# EAGLE design VFDControl (EAGLE 6.6.0)
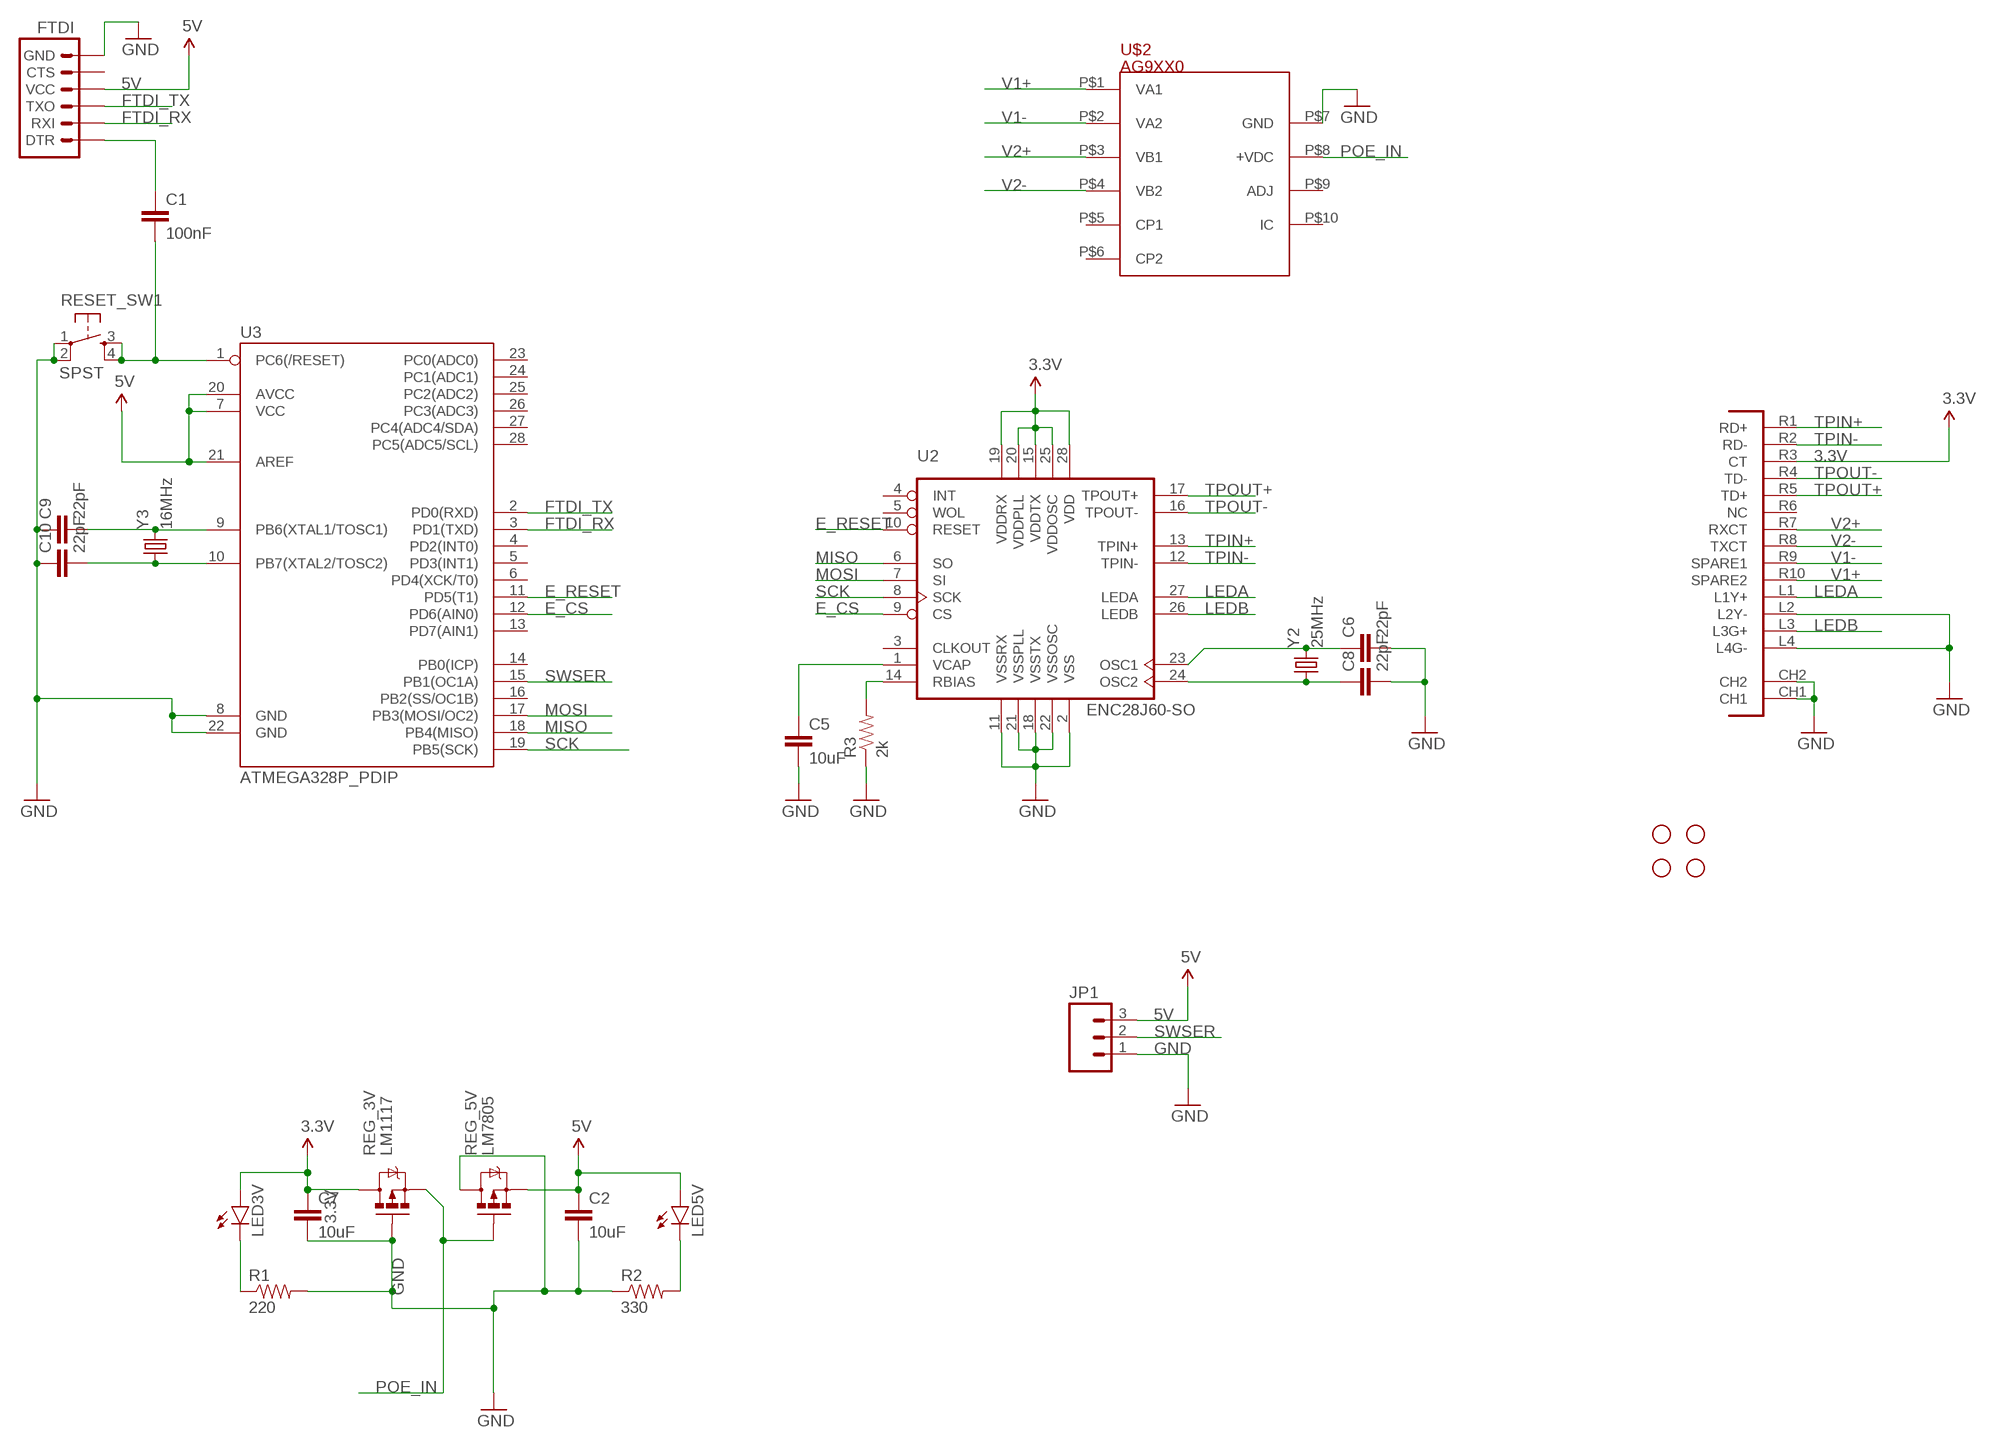
[diagram p0: schematic, sheet 1]

## Parts
C1  100nF  CAPPTH  [CAP-PTH-SMALL]
C2  10uF  CAPPTH  [CAP-PTH-SMALL]
C5  10uF  CAPPTH  [CAP-PTH-SMALL]
C6  22pF  CAPPTH  [CAP-PTH-SMALL]
C7  10uF  CAPPTH  [CAP-PTH-SMALL]
C8  22pF  CAPPTH  [CAP-PTH-SMALL]
C9  22pF  CAPPTH  [CAP-PTH-SMALL]
C10  22pF  CAPPTH  [CAP-PTH-SMALL]
FTDI  ARDUINO_SERIAL_PROGRAMPTH  [1X06]
JP1  M03PTH  [1X03]
LED3V  LED3MM  [LED3MM]
LED5V  LED3MM  [LED3MM]
R1  220  RESISTORPTH-1/4W-VERT  [AXIAL-0.1]
R2  330  RESISTORPTH-1/4W-VERT  [AXIAL-0.1]
R3  2k  RESISTORPTH-1/4W-VERT  [AXIAL-0.1]
REG_3V  LM1117  MOSFET-PCHANNELFQP27P06  [TO220V]
REG_5V  LM7805  MOSFET-PCHANNELFQP27P06  [TO220V]
RESET_SW1  SPST  TACTILE-SWITCH-PTH  [TAC-SWITCH-PTH]
STANDOFF1  STAND-OFF  [STAND-OFF]
STANDOFF2  STAND-OFF  [STAND-OFF]
STANDOFF3  STAND-OFF  [STAND-OFF]
STANDOFF4  STAND-OFF  [STAND-OFF]
U2  ENC28J60-SO  [SO28W]
U3  ATMEGA328P_PDIP  [DIL28-3]
U$2  AG9XX0  [AG9000]
U$3  POE-RJ45  [POE-RJ45]
Y2  25MHz  CRYSTALHC49US  [HC49US]
Y3  16MHz  CRYSTALHC49US  [HC49US]

## Nets
3.3V: C7.1 LED3V.A REG_3V.2(D) U2.15(VDDTX) U2.19(VDDRX) U2.20(VDDPLL) U2.25(VDDOSC) U2.28(VDD) U$3.R3(CT)
5V: C2.1 FTDI.4(VCC) JP1.3 LED5V.A REG_5V.3(S) U3.7(VCC) U3.20(AVCC) U3.21(AREF)
E_CS: U2.9(CS) U3.12(PD6(AIN0))
E_RESET: U2.10(RESET) U3.11(PD5(T1))
FTDI_RX: FTDI.2(RXI) U3.3(PD1(TXD))
FTDI_TX: FTDI.3(TXO) U3.2(PD0(RXD))
GND: C2.2 C5.2 C6.2 C7.2 C8.2 C9.1 C10.1 FTDI.6(GND) JP1.1 R1.P$2 R2.P$1 R3.P$1 REG_3V.1(G) REG_5V.2(D) RESET_SW1.1 RESET_SW1.2 U2.2(VSS) U2.11(VSSRX) U2.18(VSSTX) U2.21(VSSPLL) U2.22(VSSOSC) U3.8(GND) U3.22(GND) U$2.P$7(GND) U$3.CH1 U$3.CH2 U$3.L2(L2Y-) U$3.L4(L4G-)
LEDA: U2.27(LEDA) U$3.L1(L1Y+)
LEDB: U2.26(LEDB) U$3.L3(L3G+)
MISO: U2.6(SO) U3.18(PB4(MISO))
MOSI: U2.7(SI) U3.17(PB3(MOSI/OC2))
N$1: LED3V.K(C) R1.P$1
N$2: LED5V.K(C) R2.P$2
N$3: R3.P$2 U2.14(RBIAS)
N$4: C5.1 U2.1(VCAP)
N$5: C6.1 U2.23(OSC1) Y2.2
N$6: C8.1 U2.24(OSC2) Y2.1
N$20: C9.2 U3.9(PB6(XTAL1/TOSC1)) Y3.2
N$21: C10.2 U3.10(PB7(XTAL2/TOSC2)) Y3.1
N$37: C1.1 FTDI.1(DTR)
POE_IN: REG_3V.3(S) REG_5V.1(G) U$2.P$8(+VDC)
RESET: C1.2 RESET_SW1.3 RESET_SW1.4 U3.1(PC6(/RESET))
SCK: U2.8(SCK) U3.19(PB5(SCK))
SWSER: JP1.2 U3.15(PB1(OC1A))
TPIN+: U2.13(TPIN+) U$3.R1(RD+)
TPIN-: U2.12(TPIN-) U$3.R2(RD-)
TPOUT+: U2.17(TPOUT+) U$3.R5(TD+)
TPOUT-: U2.16(TPOUT-) U$3.R4(TD-)
V1+: U$2.P$1(VA1) U$3.R10(SPARE2)
V1-: U$2.P$2(VA2) U$3.R9(SPARE1)
V2+: U$2.P$3(VB1) U$3.R7(RXCT)
V2-: U$2.P$4(VB2) U$3.R8(TXCT)
Unconnected: FTDI.5(CTS) U2.3(CLKOUT) U2.4(INT) U2.5(WOL) U3.4(PD2(INT0)) U3.5(PD3(INT1)) U3.6(PD4(XCK/T0)) U3.13(PD7(AIN1)) U3.14(PB0(ICP)) U3.16(PB2(SS/OC1B)) U3.23(PC0(ADC0)) U3.24(PC1(ADC1)) U3.25(PC2(ADC2)) U3.26(PC3(ADC3)) U3.27(PC4(ADC4/SDA)) U3.28(PC5(ADC5/SCL)) U$2.P$5(CP1) U$2.P$6(CP2) U$2.P$9(ADJ) U$2.P$10(IC) U$3.R6(NC)

## Library data of the parts
C1 C2 C5-C10 = SparkFun-Capacitors:CAP: Capacitor Standard 0603 ceramic capacitor, and 0.1" leaded capacitor.
FTDI = SparkFun-Connectors:ARDUINO_SERIAL_PROGRAM: FTDI connector footprints
JP1 = SparkFun-Connectors:M03: Header 3 Standard 3-pin 0.1" header. Use with straight break away headers (SKU : PRT-00116), right angle break away headers (PRT-00553), swiss pins (PRT-00743), machine pins (PRT-00117), and female headers (PRT-00115). Molex polarized connector foot print use with SKU : PRT-08232 with associated crimp pins and housings.
LED3V LED5V = SparkFun-LED:LED: LEDs Standard schematic elements and footprints for 5mm, 3mm, 1206, and 0603 sized LEDs. 5mm - Spark Fun Electronics SKU : COM-00529 (and others)
R1-R3 = SparkFun-Resistors:RESISTOR: Resistor Basic schematic elements and footprints for 0603, 1206, and PTH resistors.
REG_3V REG_5V = User-Submitted:MOSFET-PCHANNEL: Generic PMOSFET IRLML2244 - TRANS-11153 (SOT-23 -20V -4.3A) (1.Gate 2.Source 3.Drain) FQP27P06 - COM-10349 <http://www.sparkfun.com/products/10349> (TO-220 -60V -27A) (1.Gate 2.Source 3.Drain)
RESET_SW1 = GeekAmmo:TACTILE-SWITCH: Tactile Switch 4 Pins, SPST NO
STANDOFF1-STANDOFF4 = SparkFun-Electromechanical:STAND-OFF: #4 Stand Off This is the mechanical footprint for a #4 phillips button head screw. Use the keepout ring to avoid running the screw head into surrounding components. SKU : PRT-00447
U2 = microchip-enc28j60:ENC28J60-*: Microchip 10Mbit Eth. contoller with SPI interface
U3 = SparkFun-DigitalIC:ATMEGA328P_PDIP: uC used in the Arduino 32kb flash, 1k EEPROM, 2k SRAM This is the through-hole version of this chip.
U$2 = SmartPrj:AG9XX0: PoE module
U$3 = SmartPrj:POE-RJ45
Y2 Y3 = SparkFun-FreqCtrl:CRYSTAL: Various standard crystals. Proven footprints.

## Board
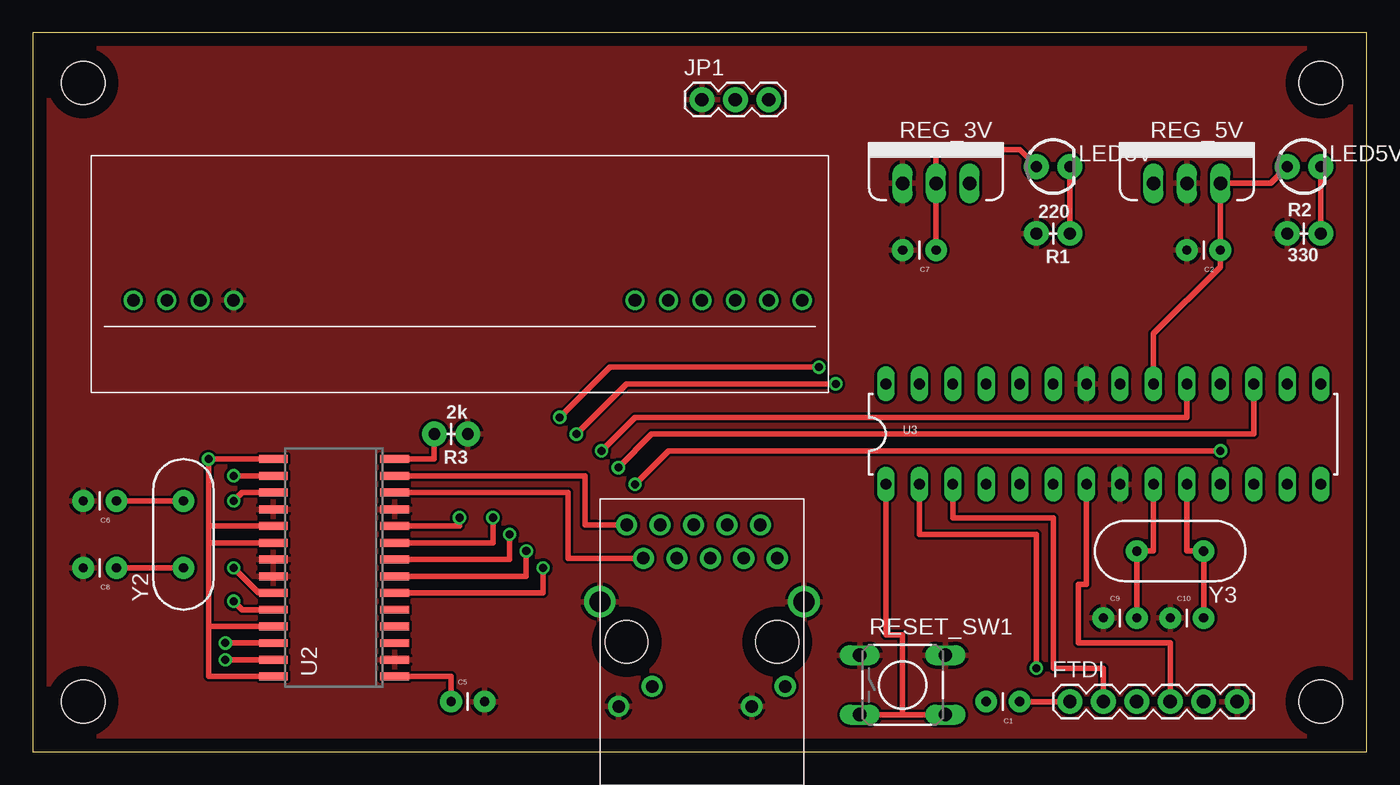
[diagram p1: board, top side]
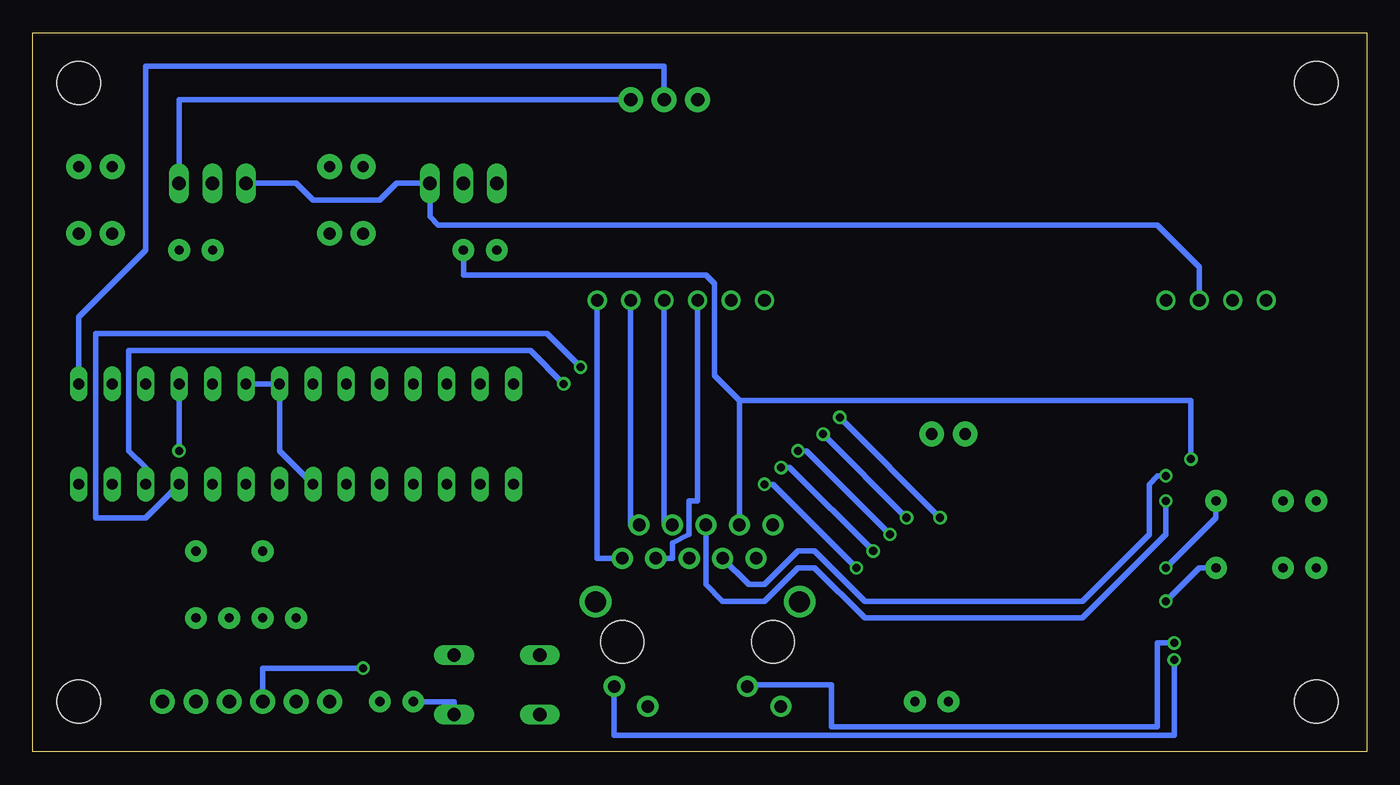
[diagram p2: board, bottom side, seen from below]

Size 101.27 x 54.6 mm. Coordinates in mm from the lower left corner, seen from the top.
Outline: 0,0 101.27,0 101.27,54.6 0,54.6 0,0
Copper layers (1*16): Top 0.035mm / dielectric 1.5mm / Bottom 0.035mm
Design rules "default": minimum track width 10mil, minimum drill 24mil, track to track 8mil, track to pad 8mil, pad to pad 8mil, via to via 8mil, smd to smd 8mil, copper to edge 40mil, drill to drill 8mil, minimum pad ring 10mil, minimum via ring 8mil, stop-mask expansion 4mil, vias tented up to drill 0mil, thermal gap 10mil

### Footprints (pad centres in the part's own frame; a part is rotated, then mirrored left to right if it is on the bottom)
CAP-PTH-SMALL = drill 0.7 pad 1.651: 1 0,0; 2 2.54,0
1X06 = drill 1.016 pad 1.88: 1 0,0; 2 2.54,0; 3 5.08,0; 4 7.62,0; 5 10.16,0; 6 12.7,0
1X03 = drill 1.016 pad 1.88: 1 0,0; 2 2.54,0; 3 5.08,0
LED3MM = drill 0.813 pad 1.88: A -1.27,0; K 1.27,0
AXIAL-0.1 = drill 0.9 pad 1.88: P$1 0,0; P$2 2.54,0
TO220V = drill 1.016 long: 1 -2.54,0; 2 0,0; 3 2.54,0
TAC-SWITCH-PTH = drill 1.016 pad 1.524 long: 1 -3.251,2.261; 2 3.251,2.261; 3 -3.251,-2.261; 4 3.251,-2.261
STAND-OFF = hole 3.302: 0,0
SO28W = smd 0.6 x 2.2: 1 -8.255,-4.6; 2 -6.985,-4.6; 3 -5.715,-4.6; 4 -4.445,-4.6; 5 -3.175,-4.6; 6 -1.905,-4.6; 7 -0.635,-4.6; 8 0.635,-4.6; 9 1.905,-4.6; 10 3.175,-4.6; 11 4.445,-4.6; 12 5.715,-4.6; 13 6.985,-4.6; 14 8.255,-4.6; 15 8.255,4.6; 16 6.985,4.6; 17 5.715,4.6; 18 4.445,4.6; 19 3.175,4.6; 20 1.905,4.6; 21 0.635,4.6; 22 -0.635,4.6; 23 -1.905,4.6; 24 -3.175,4.6; 25 -4.445,4.6; 26 -5.715,4.6; 27 -6.985,4.6; 28 -8.255,4.6
DIL28-3 = drill 0.813 long: 1 -16.51,-3.81; 2 -13.97,-3.81; 3 -11.43,-3.81; 4 -8.89,-3.81; 5 -6.35,-3.81; 6 -3.81,-3.81; 7 -1.27,-3.81; 8 1.27,-3.81; 9 3.81,-3.81; 10 6.35,-3.81; 11 8.89,-3.81; 12 11.43,-3.81; 13 13.97,-3.81; 14 16.51,-3.81; 15 16.51,3.81; 16 13.97,3.81; 17 11.43,3.81; 18 8.89,3.81; 19 6.35,3.81; 20 3.81,3.81; 21 1.27,3.81; 22 -1.27,3.81; 23 -3.81,3.81; 24 -6.35,3.81; 25 -8.89,3.81; 26 -11.43,3.81; 27 -13.97,3.81; 28 -16.51,3.81
AG9000 = drill 0.95 pad 1.422: P$1 0,0; P$2 2.54,0; P$3 5.08,0; P$4 7.62,0; P$5 10.16,0; P$6 12.7,0; P$7 43.18,0; P$8 45.72,0; P$9 48.26,0; P$10 50.8,0
POE-RJ45 = drill 1.6: CH1 13.94,7.75; CH2 13.94,-7.75 | drill 0.95 pad 1.6: L1 7.51,-6.325; L2 5.99,-3.785; L3 7.51,3.785; L4 5.99,6.325; R1 19.77,5.715; R2 17.23,4.445; R3 19.77,3.175; R4 17.23,1.905; R5 19.77,0.635; R6 17.23,-0.635; R7 19.77,-1.905; R8 17.23,-3.175; R9 19.77,-4.445; R10 17.23,-5.715 | hole 3.25: 10.89,5.715; 10.89,-5.715
HC49US = drill 0.7 pad 1.651: 1 -2.54,0; 2 2.54,0

### Placement (x,y rotation side)
C1  74.93,3.81 180 top
C2  90.17,38.1 180 top
C5  31.75,3.81 0 top
C6  6.35,19.05 180 top
C7  68.58,38.1 180 top
C8  6.35,13.97 180 top
C9  81.28,10.16 0 top
C10  86.36,10.16 0 top
FTDI  78.74,3.81 0 top
JP1  50.8,49.53 0 top
LED3V  77.47,44.45 0 top
LED5V  96.52,44.45 0 top
R1  78.74,39.37 180 top
R2  95.25,39.37 0 top
R3  33.02,24.13 180 top
REG_3V  68.58,43.18 0 top
REG_5V  87.63,43.18 0 top
RESET_SW1  66.04,5.08 0 top
STANDOFF1  97.79,50.8 0 top
STANDOFF2  97.79,3.81 0 top
STANDOFF3  3.81,3.81 0 top
STANDOFF4  3.81,50.8 0 top
U2  22.86,13.97 90 top
U3  81.28,24.13 0 top
U$2  58.42,34.29 180 top
U$3  50.8,-2.54 90 top
Y2  11.43,16.51 90 top
Y3  86.36,15.24 180 top

### Tracks (layer width: path | path; a pad name or v marks a point on that pad's centre or on a via)
3.3V  (via drill 0.61)
  Top 0.406: U2.25 13.34,9.53 | 13.34,9.53 13.34,5.71 U2.28 | U2.20 13.34,15.88 | 13.34,15.88 13.34,9.53 | U2.19 13.34,17.14 | 13.34,17.14 13.34,15.88 | U2.15 v13.34,22.23 13.34,17.14 | LED3V.A 74.93,45.72 68.58,45.72 REG_3V.2 C7.1
  Bottom 0.406: U$3.R3 47.62,26.67 | 47.62,26.67 13.34,26.67 v13.34,22.23 | 47.62,26.67 49.53,28.57 49.53,35.56 50.16,36.2 68.58,36.2 C7.1
5V
  Top 0.406: U3.7 80.01,12.7 79.38,12.7 79.38,8.26 86.36,8.26 FTDI.4 | LED5V.A 93.98,43.18 REG_5V.3 C2.1 90.17,36.83 85.09,31.75 U3.20
  Bottom 0.406: U3.7 82.55,22.86 U3.21 U3.20 | JP1.3 90.17,49.53 REG_5V.3
E_CS  (via drill 0.61)
  Top 0.406: U2.9 34.92,15.88 v34.92,17.78 | v41.27,24.13 45.09,27.94 v60.96,27.94
  Bottom 0.406: v34.92,17.78 v41.27,24.13 | v60.96,27.94 63.5,30.48 93.98,30.48 93.98,22.86 92.71,21.59 U3.12
E_RESET  (via drill 0.61)
  Top 0.406: U2.10 32.38,17.14 v32.38,17.78 | v40.01,25.4 43.81,29.21 v59.69,29.21
  Bottom 0.406: v32.38,17.78 v40.01,25.4 | v59.69,29.21 62.23,31.75 96.52,31.75 96.52,17.78 92.71,17.78 U3.11
FTDI_RX
  Top 0.406: U3.3 69.85,17.78 77.47,17.78 77.47,6.35 81.28,6.35 FTDI.2
FTDI_TX  (via drill 0.61)
  Top 0.406: U3.2 67.31,16.51 76.2,16.51 v76.2,6.35
  Bottom 0.406: FTDI.3 83.82,6.35 v76.2,6.35
GND
  pour Top: 0,0 101.6,0 101.6,54.61 0,54.61
LEDA  (via drill 0.61)
  Top 0.406: U2.27 v14.61,6.99
  Bottom 0.406: v14.61,6.99 14.61,1.27 57.15,1.27 57.15,4.97 U$3.L1
LEDB  (via drill 0.61)
  Top 0.406: U2.26 v14.61,8.26
  Bottom 0.406: U$3.L3 47.02,5.08 40.64,5.08 40.64,1.91 15.88,1.91 15.88,8.26 v14.61,8.26
MISO  (via drill 0.61)
  Top 0.406: U2.6 38.73,12.06 v38.73,13.97 | v45.72,20.32 48.26,22.86 v90.17,22.86
  Bottom 0.406: U3.18 v90.17,22.86 | v38.73,13.97 45.09,20.32 v45.72,20.32
MOSI  (via drill 0.61)
  Top 0.406: U2.7 37.47,13.34 v37.47,15.24 | v44.45,21.59 46.99,24.13 92.71,24.13 U3.17
  Bottom 0.406: v37.47,15.24 43.81,21.59 v44.45,21.59
N$1
  Top 0.406: LED3V.K R1.P$1
N$2
  Top 0.406: LED5V.K R2.P$2
N$3
  Top 0.406: U2.14 30.48,22.23 R3.P$2
N$4
  Top 0.406: U2.1 31.75,5.71 C5.1
N$5  (via drill 0.61)
  Top 0.406: C6.1 Y2.2 | U2.23 17.14,12.06 v15.24,13.97
  Bottom 0.406: Y2.2 11.43,17.78 v15.24,13.97
N$6  (via drill 0.61)
  Top 0.406: C8.1 Y2.1 | U2.24 15.88,10.79 v15.24,11.43
  Bottom 0.406: Y2.1 12.7,13.97 v15.24,11.43
N$20
  Top 0.406: C9.2 Y3.2 85.09,15.24 U3.9
N$21
  Top 0.406: C10.2 Y3.1 87.63,15.24 U3.10
N$37
  Top 0.406: C1.1 FTDI.1
POE_IN
  Bottom 0.406: REG_5V.1 81.28,43.18 80.01,41.91 74.93,41.91 73.66,43.18 REG_3V.3 71.12,40.64 70.48,40.01 15.88,40.01 12.7,36.83 U$2.P$8
RESET
  Top 0.406: U3.1 64.77,8.89 66.04,8.89 66.04,2.82 | 66.04,2.82 RESET_SW1.3 | 66.04,2.82 RESET_SW1.4
  Bottom 0.406: C1.2 69.29,3.81 RESET_SW1.4
SCK  (via drill 0.61)
  Top 0.406: U2.8 36.2,14.61 v36.2,16.51 | v43.18,22.86 45.72,25.4 87.63,25.4 U3.19
  Bottom 0.406: v36.2,16.51 42.55,22.86 v43.18,22.86
SWSER
  Bottom 0.406: U3.15 97.79,33.02 92.71,38.1 92.71,52.07 53.34,52.07 JP1.2
TPIN+
  Top 0.406: U2.13 41.91,20.95 41.91,17.23 U$3.R1
TPIN-
  Top 0.406: U2.12 40.64,19.68 40.64,14.69 U$3.R2
TPOUT+  (via drill 0.61)
  Top 0.406: U2.17 15.88,19.68 v15.24,19.05
  Bottom 0.406: v15.24,19.05 15.24,16.51 21.59,10.16 38.1,10.16 41.91,13.97 43.18,13.97 45.72,11.43 48.9,11.43 50.16,12.7 U$3.R5
TPOUT-  (via drill 0.61)
  Top 0.406: U2.16 v15.24,20.95
  Bottom 0.406: v15.24,20.95 15.88,20.95 16.51,20.32 16.51,16.51 21.59,11.43 38.1,11.43 41.91,15.24 43.18,15.24 45.72,12.7 46.91,12.7 U$3.R4
V1+
  Bottom 0.406: U$3.R10 58.42,14.69 U$2.P$1
V1-
  Bottom 0.406: U$3.R9 55.88,17.23 U$2.P$2
V2+
  Bottom 0.406: U$3.R7 53.34,17.23 U$2.P$3
V2-
  Bottom 0.406: U$3.R8 52.7,14.69 52.7,15.88 51.44,16.51 51.44,19.05 50.8,19.05 U$2.P$4